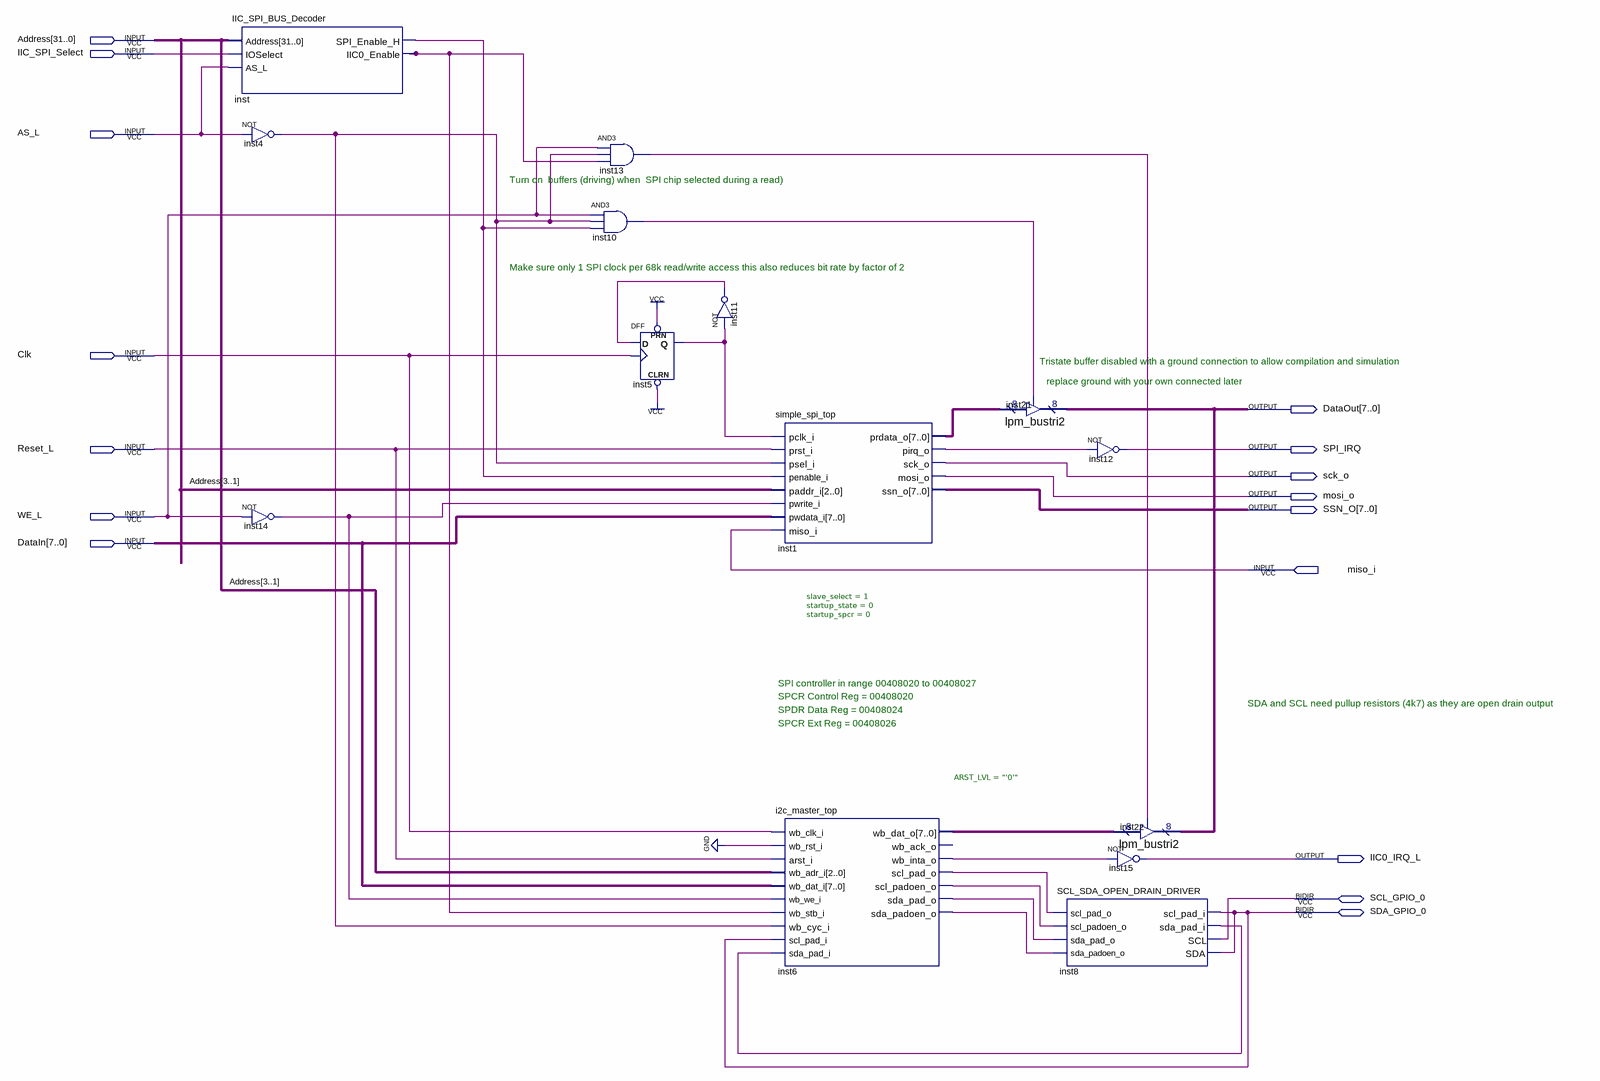
[diagram p0: schematic sheet]
// Quartus schematic IIC_SPI_Interface.bdf as structural Verilog: 14 symbols, 16 pins
module IIC_SPI_Interface (
  input  [31:0] Address,
  input  IIC_SPI_Select,
  input  AS_L,
  input  Clk,
  input  Reset_L,
  input  WE_L,
  input  [7:0] DataIn,
  input  miso_i,
  inout  SCL_GPIO_0,
  inout  SDA_GPIO_0,
  output [7:0] DataOut,
  output SPI_IRQ,
  output sck_o,
  output mosi_o,
  output [7:0] SSN_O,
  output IIC0_IRQ_L
);

  wire inst1_pirq_o, inst4_out, inst5_q, inst6_scl_pad_o, inst6_scl_padoen_o, inst6_sda_pad_o,
       inst6_sda_padoen_o, inst6_wb_inta_o, inst8_sda_pad_i, inst10_out, inst11_out, inst13_out, inst14_out,
       inst_iic0_enable, inst_spi_enable_h;
  wire [7:0] inst1_prdata_o, inst6_wb_dat_o;

  IIC_SPI_BUS_Decoder inst (
    .Address(Address), .IOSelect(IIC_SPI_Select), .AS_L(AS_L), .SPI_Enable_H(inst_spi_enable_h),
    .IIC0_Enable(inst_iic0_enable));
  not inst4 (inst4_out, AS_L);
  not inst14 (inst14_out, WE_L);
  and inst13 (inst13_out, WE_L, inst4_out, inst_iic0_enable);
  and inst10 (inst10_out, WE_L, inst4_out, inst_spi_enable_h);
  DFF inst5 (.CLRN(1'b1), .CLK(Clk), .D(inst11_out), .PRN(1'b1), .Q(inst5_q));
  not inst11 (inst11_out, inst5_q);
  simple_spi_top #(.slave_select(1), .startup_state(0), .startup_spcr(0)) inst1 (
    .pclk_i(inst5_q), .prst_i(Reset_L), .psel_i(inst4_out), .penable_i(inst_spi_enable_h),
    .paddr_i(Address[3:1]), .pwrite_i(inst14_out), .pwdata_i(DataIn), .miso_i(miso_i),
    .prdata_o(inst1_prdata_o), .pirq_o(inst1_pirq_o), .sck_o(sck_o), .mosi_o(mosi_o), .ssn_o(SSN_O));
  i2c_master_top #(.ARST_LVL("'0'")) inst6 (
    .wb_clk_i(Clk), .wb_rst_i(1'b0), .arst_i(Reset_L), .wb_adr_i(Address[3:1]), .wb_dat_i(DataIn),
    .wb_we_i(inst14_out), .wb_stb_i(inst_iic0_enable), .wb_cyc_i(inst4_out), .scl_pad_i(SDA_GPIO_0),
    .sda_pad_i(inst8_sda_pad_i), .wb_dat_o(inst6_wb_dat_o), .wb_inta_o(inst6_wb_inta_o),
    .scl_pad_o(inst6_scl_pad_o), .scl_padoen_o(inst6_scl_padoen_o), .sda_pad_o(inst6_sda_pad_o),
    .sda_padoen_o(inst6_sda_padoen_o));  // open: wb_ack_o
  lpm_bustri2 inst21 (.enabledt(inst10_out), .data(inst1_prdata_o), .tridata(DataOut));
  SCL_SDA_OPEN_DRAIN_DRIVER inst8 (
    .scl_pad_o(inst6_scl_pad_o), .scl_padoen_o(inst6_scl_padoen_o), .sda_pad_o(inst6_sda_pad_o),
    .sda_padoen_o(inst6_sda_padoen_o), .scl_pad_i(SDA_GPIO_0), .sda_pad_i(inst8_sda_pad_i), .SCL(SCL_GPIO_0),
    .SDA(SDA_GPIO_0));
  not inst12 (SPI_IRQ, inst1_pirq_o);
  lpm_bustri2 inst22 (.enabledt(inst13_out), .data(inst6_wb_dat_o), .tridata(DataOut));
  not inst15 (IIC0_IRQ_L, inst6_wb_inta_o);

  // Notes on the sheet:
  //   Turn on  buffers (driving) when  SPI chip selected during a read)
  //   Make sure only 1 SPI clock per 68k read/write access this also reduces bit rate by factor of 2
  //   Tristate buffer disabled with a ground connection to allow compilation and simulation
  //   replace ground with your own connected later
  //   SPI controller in range 00408020 to 00408027
  //   SPCR Control Reg = 00408020
  //   SDA and SCL need pullup resistors (4k7) as they are open drain output
  //   SPDR Data Reg = 00408024
  //   SPCR Ext Reg = 00408026
endmodule
